# Altium project Bop_it.PrjPcb
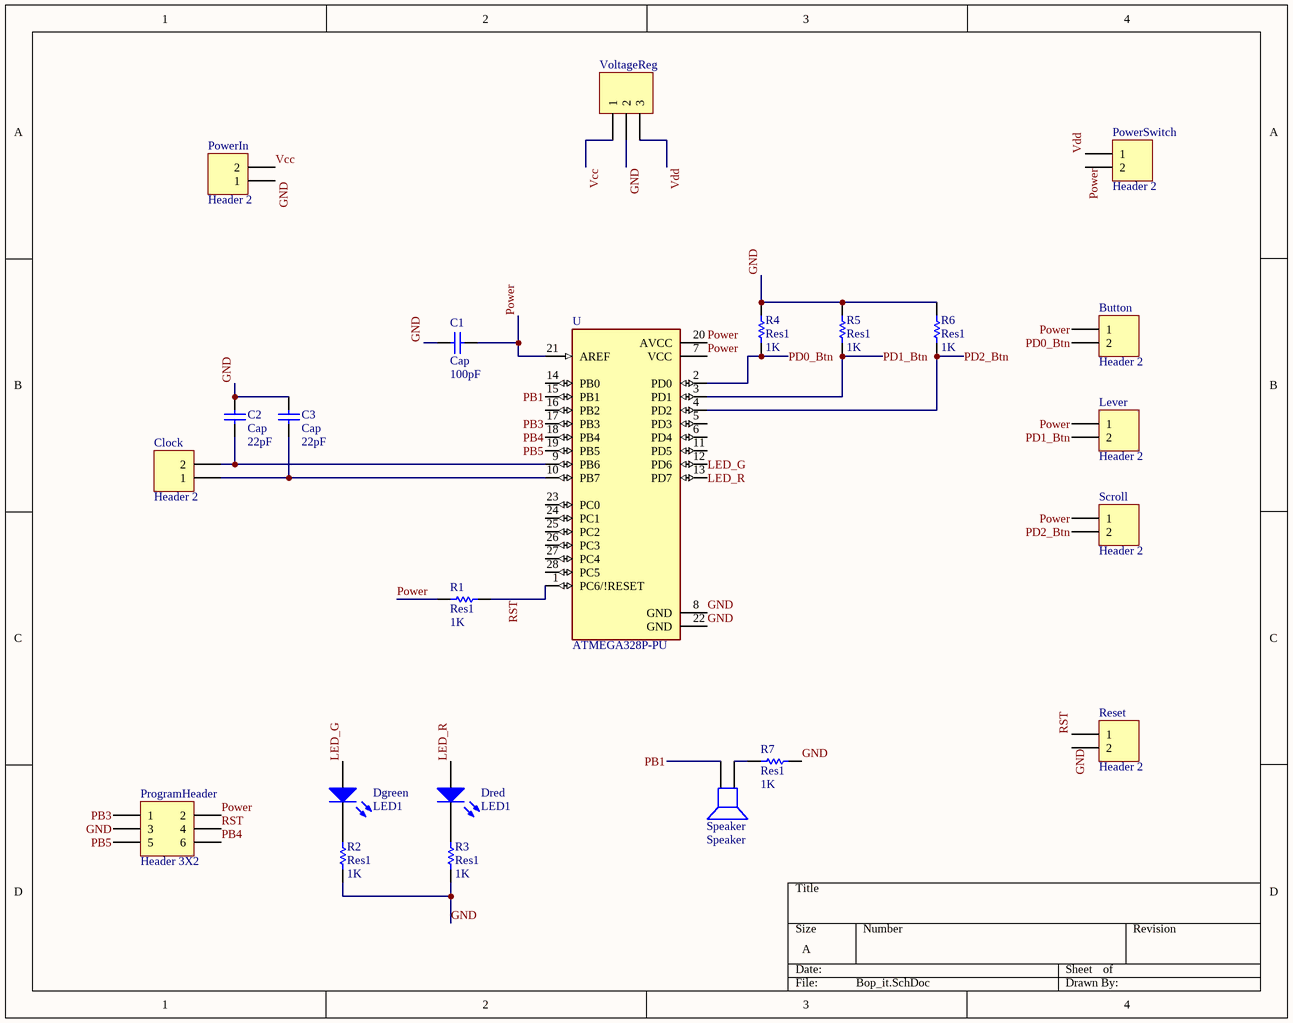
[diagram p0: Bop_it.SchDoc]
1 sheet, 23 parts. Net scope: global (net labels, ports and power ports of the same name join across sheets).

## Sheet Bop_it.SchDoc
size A; SheetNumber: 1; SheetTotal: 1; SPICEModelCacheHRIOOMPZ: <root> / <DocumentId>HRIOOMPZ</DocumentId> / <CacheFrame Number="0"> / <Model Name="cap" Kind="MDL"> / <Text>*Default semiconductor capacitor / .MODEL CAP C()</Text> / </Model> / <Model Name="led1" Kind="MDL"> / <Text>*Typ RED GaAs LED: Vf=1.7V Vr=4V If=40mA trr=3uS / *LED Pinout: 1=A, 2=K / .MODEL LED1 D (IS=93.2P RS=42M N=3.73 BV=4 IBV=10U / + CJO=2.97P VJ=.75 M=.333 TT=4.32U)</Text> / </Model> / <Model Name="nmos" Kind="MDL"> / <Text>*Default N-Channel MOSFET / *Pinout: D,G,S / .MODEL NMOS NMOS()</Text> / </Model> / </CacheFrame> / </root>

### Parts
Button  Header 2  [HDR1X2]
C1  Cap  value 100pF  [RAD-0.3]
C2  Cap  value 22pF  [RAD-0.3]
C3  Cap  value 22pF  [RAD-0.3]
Clock  Header 2  [HDR1X2]
Dgreen  LED1  [LED-1]
Dred  LED1  [LED-1]
Lever  Header 2  [HDR1X2]
PowerIn  Header 2  [HDR1X2]
PowerSwitch  Header 2  [HDR1X2]
ProgramHeader  Header 3X2  [HDR2X3]
R1  Res1  value 1K  [AXIAL-0.3]
R2  Res1  value 1K  [AXIAL-0.3]
R3  Res1  value 1K  [AXIAL-0.3]
R4  Res1  value 1K  [AXIAL-0.3]
R5  Res1  value 1K  [AXIAL-0.3]
R6  Res1  value 1K  [AXIAL-0.3]
R7  Res1  value 1K  [AXIAL-0.3]
Reset  Header 2  [HDR1X2]
Scroll  Header 2  [HDR1X2]
Speaker  Speaker  [PIN2]
U  ATMEGA328P-PU  [DIP794W46P254L2967H457Q28B]
VoltageReg  (no value)  [HDR1X3]

### Nets
GND: C1.1 C2.2 C3.1 PowerIn.1 ProgramHeader.3 R2.2 R3.2 R4.1 R5.1 R6.1 R7.2 Reset.2 U.8(GND) U.22(GND) VoltageReg.2
LED_G: Dgreen.1(A) U.12(PD6)
LED_R: Dred.1(A) U.13(PD7)
PB1: Speaker.2 U.15(PB1)
PB3: ProgramHeader.1 U.17(PB3)
PB4: ProgramHeader.6 U.18(PB4)
PB5: ProgramHeader.5 U.19(PB5)
PD0_Btn: Button.2 R4.2 U.2(PD0)
PD1_Btn: Lever.2 R5.2 U.3(PD1)
PD2_Btn: R6.2 Scroll.2 U.4(PD2)
Power: Button.1 C1.2 Lever.1 PowerSwitch.2 ProgramHeader.2 R1.1 Scroll.1 U.7(VCC) U.20(AVCC) U.21(AREF)
RST: ProgramHeader.4 R1.2 Reset.1 U.1(PC6/!RESET)
Vcc: PowerIn.2 VoltageReg.1
Vdd: PowerSwitch.1 VoltageReg.3
NetC2_1: C2.1 Clock.2 U.9(PB6)
NetC3_2: C3.2 Clock.1 U.10(PB7)
NetDgreen_2: Dgreen.2(K) R2.1
NetDred_2: Dred.2(K) R3.1
NetR7_1: R7.1 Speaker.1

Not connected (* = marked no-connect by the designer): U 5(PD3) 6(PD4) 11(PD5) 14(PB0) 16(PB2) 23(PC0) 24(PC1) 25(PC2) 26(PC3) 27(PC4) 28(PC5)

### Library data of the parts
Button Clock Lever PowerIn PowerSwitch Reset Scroll = Header 2: Header, 2-Pin; LatestRevisionDate: 17-Jul-2002; LatestRevisionNote: Re-released for DXP Platform.; Publisher: Altium Limited
C1-C3 = Cap: Capacitor; Published: 8-Jun-2000; LatestRevisionDate: 17-Jul-2002; LatestRevisionNote: Re-released for DXP Platform.; PackageReference: RAD-0.3; Publisher: Altium Limited; PackageDescription: Radial Cap, Thru-Hole; 2 Leads; 0.3 in Pin Spacing
Dgreen Dred = LED1: Typical RED GaAs LED; Published: 8-Jun-2000; LatestRevisionDate: 08-Jul-2005; LatestRevisionNote: Mech Layer 1 removed.; PackageReference: LED-1; Publisher: Altium Limited; PackageDescription: LED; 2 Leads
ProgramHeader = Header 3X2: Header, 3-Pin, Dual row; LatestRevisionDate: 17-Jul-2002; LatestRevisionNote: Re-released for DXP Platform.; Publisher: Altium Limited
R1-R7 = Res1: Resistor; Published: 8-Jun-2000; LatestRevisionDate: 17-Jul-2002; LatestRevisionNote: Re-released for DXP Platform.; PackageReference: AXIAL-0.3; Publisher: Altium Limited; PackageDescription: Axial Device, Thru-Hole; 2 Leads; 0.3 in Pin Spacing
Speaker = Speaker: Loudspeaker; Published: 24-Mar-1999; LatestRevisionDate: 17-Jul-2002; LatestRevisionNote: Re-released for DXP Platform.; PackageReference: PIN2; Publisher: Altium Limited
U = ATMEGA328P-PU: AVR AVRÂ® ATmega Microcontroller IC 8-Bit 20MHz 32KB _16K x 16_ FLASH 28-PDIP; MF: Microchip; Package: PDIP-28 Atmel; Value: *; Availability: Unavailable; SnapEDA_Link: https://www.snapeda.com/parts/ATMEGA328P-PU/Microchip/view-part/44282/?ref=snap; Price: None; MP: ATMEGA328P-PU
VoltageReg = Header 3: Header, 3-Pin; LatestRevisionDate: 17-Jul-2002; LatestRevisionNote: Re-released for DXP Platform.; Publisher: Altium Limited